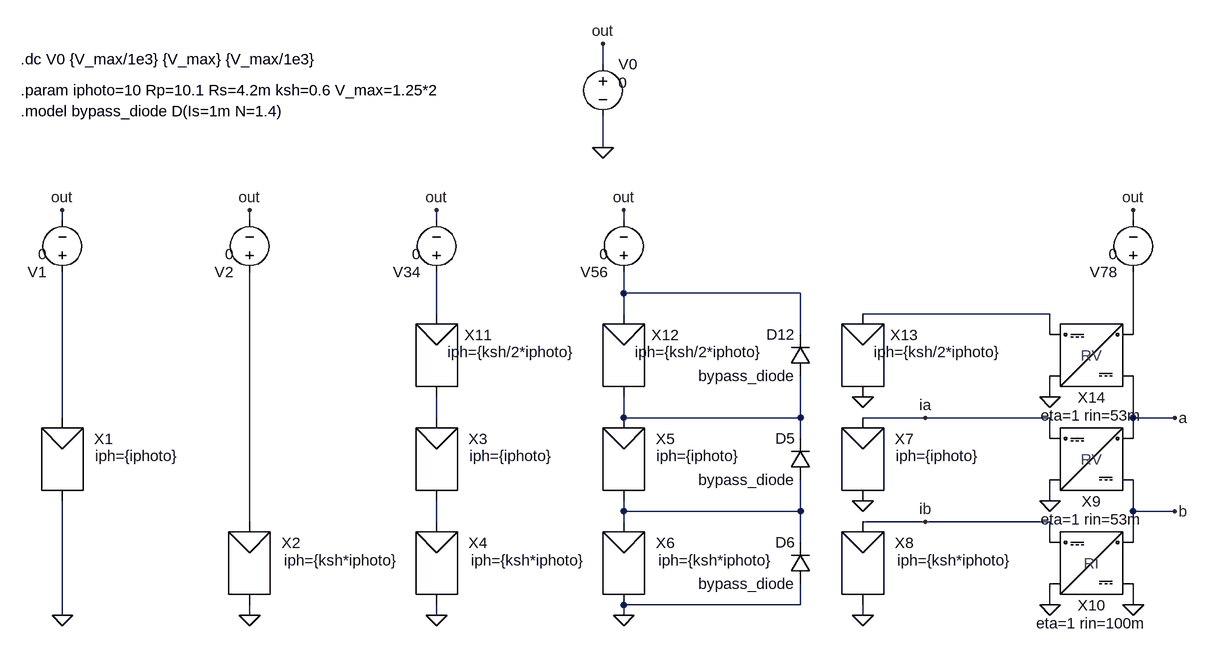
[diagram p0: schematic panel_diode_spice.asc]
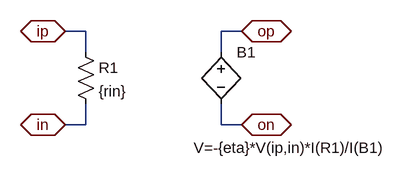
[diagram p1: sub-circuit dcdcrv.asc]
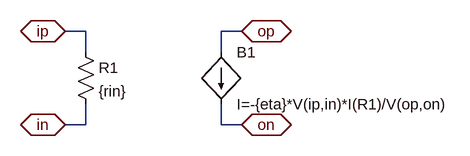
[diagram p2: sub-circuit dcdcri.asc]
panel_diode_spice.asc, the LTspice schematic file:
Version 4.1
SHEET 1 2216 1668
WIRE 784 -176 784 -208
WIRE 784 -48 784 -96
WIRE -48 64 -48 48
WIRE 240 64 240 48
WIRE 528 64 528 48
WIRE 816 64 816 48
WIRE 1600 64 1600 48
WIRE 816 176 816 144
WIRE 1088 176 816 176
WIRE 528 208 528 144
WIRE 816 208 816 176
WIRE 1472 208 1184 208
WIRE 1088 240 1088 176
WIRE 1472 240 1472 208
WIRE 1600 240 1600 144
WIRE 1472 336 1472 304
WIRE -48 368 -48 144
WIRE 528 368 528 336
WIRE 816 368 816 336
WIRE 1088 368 1088 304
WIRE 1088 368 816 368
WIRE 1280 368 1184 368
WIRE 1472 368 1280 368
WIRE 1600 368 1600 304
WIRE 1664 368 1600 368
WIRE 1088 400 1088 368
WIRE 1472 400 1472 368
WIRE 1600 400 1600 368
WIRE 1472 496 1472 464
WIRE 816 512 816 496
WIRE 1088 512 1088 464
WIRE 1088 512 816 512
WIRE 1600 512 1600 464
WIRE 1664 512 1600 512
WIRE 240 528 240 144
WIRE 528 528 528 496
WIRE 816 528 816 512
WIRE 1280 528 1184 528
WIRE 1472 528 1280 528
WIRE 1088 560 1088 512
WIRE 1472 560 1472 528
WIRE 1600 560 1600 512
WIRE 1088 656 1088 624
WIRE 1088 656 816 656
WIRE 1472 656 1472 624
WIRE 1600 656 1600 624
WIRE -48 672 -48 496
WIRE 240 672 240 656
WIRE 528 672 528 656
WIRE 816 672 816 656
WIRE 1184 672 1184 656
FLAG 784 -48 0
FLAG 784 -208 out
FLAG 528 48 out
FLAG 528 672 0
FLAG 816 48 out
FLAG 816 672 0
FLAG -48 48 out
FLAG -48 672 0
FLAG 240 48 out
FLAG 240 672 0
FLAG 1600 48 out
FLAG 1184 672 0
FLAG 1184 496 0
FLAG 1472 496 0
FLAG 1472 656 0
FLAG 1600 656 0
FLAG 1664 368 a
FLAG 1664 512 b
FLAG 1280 368 ia
FLAG 1280 528 ib
FLAG 1184 336 0
FLAG 1472 336 0
SYMBOL voltage 784 -192 R0
WINDOW 3 24 44 Left 2
WINDOW 123 0 0 Left 0
WINDOW 39 0 0 Left 0
SYMATTR Value 0
SYMATTR InstName V0
SYMBOL pv 528 368 R0
WINDOW 0 64 48 Bottom 2
WINDOW 39 115 74 Bottom 2
SYMATTR InstName X3
SYMATTR SpiceLine iph={iphoto}
SYMBOL pv 528 528 R0
WINDOW 0 64 48 Bottom 2
WINDOW 39 141 75 Bottom 2
SYMATTR InstName X4
SYMATTR SpiceLine iph={ksh*iphoto}
SYMBOL pv 816 368 R0
WINDOW 0 64 48 Bottom 2
WINDOW 39 115 74 Bottom 2
SYMATTR InstName X5
SYMATTR SpiceLine iph={iphoto}
SYMBOL pv 816 528 R0
WINDOW 0 64 48 Bottom 2
WINDOW 39 141 75 Bottom 2
SYMATTR InstName X6
SYMATTR SpiceLine iph={ksh*iphoto}
SYMBOL diode 1104 464 R180
WINDOW 0 24 64 Left 2
WINDOW 3 24 0 Left 2
SYMATTR InstName D5
SYMATTR Value bypass_diode
SYMBOL diode 1104 624 R180
WINDOW 0 24 64 Left 2
WINDOW 3 24 0 Left 2
SYMATTR InstName D6
SYMATTR Value bypass_diode
SYMBOL voltage 528 160 R180
WINDOW 3 24 44 Left 2
WINDOW 123 0 0 Left 0
WINDOW 39 0 0 Left 0
SYMATTR Value 0
SYMATTR InstName V34
SYMBOL voltage 816 160 R180
WINDOW 3 24 44 Left 2
WINDOW 123 0 0 Left 0
WINDOW 39 0 0 Left 0
SYMATTR Value 0
SYMATTR InstName V56
SYMBOL pv -48 368 R0
WINDOW 0 64 48 Bottom 2
WINDOW 39 115 74 Bottom 2
SYMATTR InstName X1
SYMATTR SpiceLine iph={iphoto}
SYMBOL voltage -48 160 R180
WINDOW 3 24 44 Left 2
WINDOW 123 0 0 Left 0
WINDOW 39 0 0 Left 0
SYMATTR Value 0
SYMATTR InstName V1
SYMBOL pv 240 528 R0
WINDOW 0 64 48 Bottom 2
WINDOW 39 141 75 Bottom 2
SYMATTR InstName X2
SYMATTR SpiceLine iph={ksh*iphoto}
SYMBOL voltage 240 160 R180
WINDOW 3 24 44 Left 2
WINDOW 123 0 0 Left 0
WINDOW 39 0 0 Left 0
SYMATTR Value 0
SYMATTR InstName V2
SYMBOL pv 1184 368 R0
WINDOW 0 64 48 Bottom 2
WINDOW 39 115 74 Bottom 2
SYMATTR InstName X7
SYMATTR SpiceLine iph={iphoto}
SYMBOL pv 1184 528 R0
WINDOW 0 64 48 Bottom 2
WINDOW 39 141 75 Bottom 2
SYMATTR InstName X8
SYMATTR SpiceLine iph={ksh*iphoto}
SYMBOL voltage 1600 160 R180
WINDOW 3 24 44 Left 2
WINDOW 123 0 0 Left 0
WINDOW 39 0 0 Left 0
SYMATTR Value 0
SYMATTR InstName V78
SYMBOL dcdcrv 1472 400 R0
WINDOW 39 64 140 Bottom 2
SYMATTR InstName X9
SYMATTR SpiceLine eta=1 rin=53m
SYMBOL dcdcri 1472 560 R0
WINDOW 39 64 140 Bottom 2
SYMATTR InstName X10
SYMATTR SpiceLine eta=1 rin=100m
SYMBOL pv 528 208 R0
WINDOW 0 64 48 Bottom 2
WINDOW 39 115 74 Bottom 2
SYMATTR InstName X11
SYMATTR SpiceLine iph={ksh/2*iphoto}
SYMBOL pv 816 208 R0
WINDOW 0 64 48 Bottom 2
WINDOW 39 115 74 Bottom 2
SYMATTR InstName X12
SYMATTR SpiceLine iph={ksh/2*iphoto}
SYMBOL pv 1184 208 R0
WINDOW 0 64 48 Bottom 2
WINDOW 39 115 74 Bottom 2
SYMATTR InstName X13
SYMATTR SpiceLine iph={ksh/2*iphoto}
SYMBOL dcdcrv 1472 240 R0
WINDOW 39 64 140 Bottom 2
SYMATTR InstName X14
SYMATTR SpiceLine eta=1 rin=53m
SYMBOL diode 1104 304 R180
WINDOW 0 24 64 Left 2
WINDOW 3 24 0 Left 2
SYMATTR InstName D12
SYMATTR Value bypass_diode
TEXT -112 -184 Left 2 !.dc V0 {V_max/1e3} {V_max} {V_max/1e3}
TEXT -112 -136 Left 2 !.param iphoto=10 Rp=10.1 Rs=4.2m ksh=0.6 V_max=1.25*2
TEXT -112 -104 Left 2 !.model bypass_diode D(Is=1m N=1.4)

dcdcrv.asc, the sub-circuit schematic file:
Version 4.1
SHEET 1 880 680
WIRE 80 112 48 112
WIRE 320 112 288 112
WIRE 80 144 80 112
WIRE 288 144 288 112
WIRE 80 256 80 224
WIRE 80 256 48 256
WIRE 288 256 288 224
WIRE 320 256 288 256
FLAG 48 112 ip
IOPIN 48 112 BiDir
FLAG 48 256 in
IOPIN 48 256 BiDir
FLAG 320 112 op
IOPIN 320 112 BiDir
FLAG 320 256 on
IOPIN 320 256 BiDir
SYMBOL bv 288 128 R0
WINDOW 3 -42 163 Left 2
SYMATTR Value V=-{eta}*V(ip,in)*I(R1)/I(B1)
SYMATTR InstName B1
SYMBOL res 64 128 R0
SYMATTR InstName R1
SYMATTR Value {rin}

dcdcri.asc, the sub-circuit schematic file:
Version 4.1
SHEET 1 880 680
WIRE 80 112 48 112
WIRE 320 112 288 112
WIRE 80 144 80 112
WIRE 288 144 288 112
WIRE 80 256 80 224
WIRE 80 256 48 256
WIRE 288 256 288 224
WIRE 320 256 288 256
FLAG 48 112 ip
IOPIN 48 112 BiDir
FLAG 48 256 in
IOPIN 48 256 BiDir
FLAG 320 112 op
IOPIN 320 112 BiDir
FLAG 320 256 on
IOPIN 320 256 BiDir
SYMBOL res 64 128 R0
SYMATTR InstName R1
SYMATTR Value {rin}
SYMBOL bi 288 144 R0
SYMATTR InstName B1
SYMATTR Value I=-{eta}*V(ip,in)*I(R1)/V(op,on)

The netlist it stands for:
* panel_diode_spice.asc
V0 out 0 0
X§X3 N010 N006 pv iph={iphoto}  ; pins n p
X§X4 0 N010 pv iph={ksh*iphoto}  ; pins n p
X§X5 N008 N007 pv iph={iphoto}  ; pins n p
X§X6 0 N008 pv iph={ksh*iphoto}  ; pins n p
D5 N008 N007 bypass_diode
D6 0 N008 bypass_diode
V34 N002 out 0
V56 N001 out 0
X§X1 0 N005 pv iph={iphoto}  ; pins n p
V1 N005 out 0
X§X2 0 N009 pv iph={ksh*iphoto}  ; pins n p
V2 N009 out 0
X§X7 0 ia pv iph={iphoto}  ; pins n p
X§X8 0 ib pv iph={ksh*iphoto}  ; pins n p
V78 N004 out 0
X§X9 0 ia b a dcdcrv params: eta=1 rin=53m
X§X10 0 ib 0 b dcdcri params: eta=1 rin=100m
X§X11 N006 N002 pv iph={ksh/2*iphoto}  ; pins n p
X§X12 N007 N001 pv iph={ksh/2*iphoto}  ; pins n p
X§X13 0 N003 pv iph={ksh/2*iphoto}  ; pins n p
X§X14 0 N003 a N004 dcdcrv params: eta=1 rin=53m
D12 N007 N001 bypass_diode

* block symbol definitions
.subckt dcdcrv in ip on op
B1 op on V=-{eta}*V(ip,in)*I(R1)/I(B1)
R1 ip in {rin}
.ends dcdcrv

.subckt dcdcri in ip on op
R1 ip in {rin}
B1 op on I=-{eta}*V(ip,in)*I(R1)/V(op,on)
.ends dcdcri

.model D D
.lib standard.dio
.dc V0 {V_max/1e3} {V_max} {V_max/1e3}
.param iphoto=10 Rp=10.1 Rs=4.2m ksh=0.6 V_max=1.25*2
.model bypass_diode D(Is=1m N=1.4)
.backanno
.end